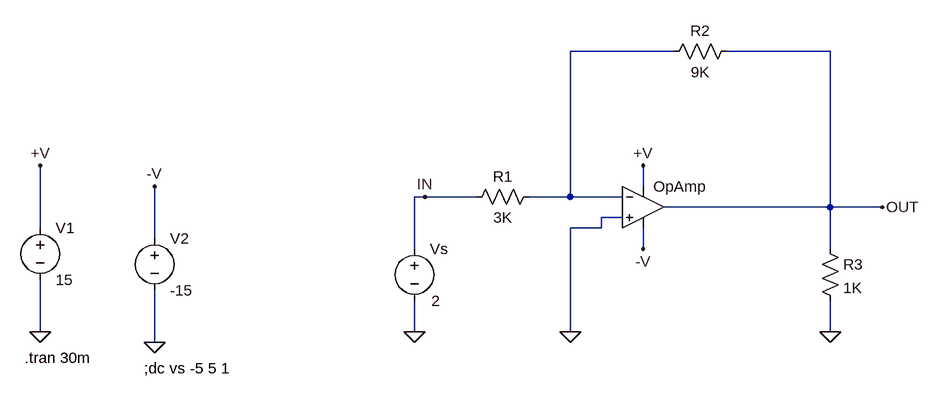
[diagram p0: schematic hw3.asc]
hw3.asc, the LTspice schematic file:
Version 4
SHEET 1 880 680
WIRE 448 -224 288 -224
WIRE 688 -224 528 -224
WIRE 400 -16 400 -48
WIRE 64 0 48 0
WIRE 144 0 64 0
WIRE 288 0 288 -224
WIRE 288 0 224 0
WIRE 368 0 288 0
WIRE 688 16 688 -224
WIRE 688 16 432 16
WIRE 768 16 688 16
WIRE 368 32 336 32
WIRE -528 48 -528 -48
WIRE 336 48 336 32
WIRE 336 48 288 48
WIRE -352 64 -352 -16
WIRE 48 80 48 0
WIRE 400 80 400 48
WIRE 688 80 688 16
WIRE -528 208 -528 128
WIRE 48 208 48 160
WIRE 288 208 288 48
WIRE 688 208 688 160
WIRE -352 224 -352 144
FLAG 48 208 0
FLAG 688 208 0
FLAG 288 208 0
FLAG 64 0 IN
FLAG 768 16 OUT
FLAG 400 -48 +V
FLAG 400 80 -V
FLAG -528 208 0
FLAG -352 224 0
FLAG -528 -48 +V
FLAG -352 -16 -V
SYMBOL res 240 -16 R90
WINDOW 0 0 56 VBottom 2
WINDOW 3 32 56 VTop 2
SYMATTR InstName R1
SYMATTR Value 3K
SYMBOL voltage 48 64 R0
WINDOW 3 40 96 Right 2
SYMATTR Value 2
SYMATTR InstName Vs
SYMBOL res 544 -240 R90
WINDOW 0 0 56 VBottom 2
WINDOW 3 32 56 VTop 2
SYMATTR InstName R2
SYMATTR Value 9K
SYMBOL res 672 64 R0
SYMATTR InstName R3
SYMATTR Value 1K
SYMBOL Opamps\\UniversalOpamp2 400 16 R0
SYMATTR InstName OpAmp
SYMBOL voltage -352 48 R0
SYMATTR InstName V2
SYMATTR Value -15
SYMBOL voltage -528 32 R0
SYMATTR InstName V1
SYMATTR Value 15
TEXT -552 248 Left 2 !.tran 30m
TEXT -368 264 Left 2 !;dc vs -5 5 1

The netlist it stands for:
* hw3.asc
R1 N001 IN 3K
Vs IN 0 2
R2 OUT N001 9K
R3 OUT 0 1K
XOpAmp 0 N001 +V -V OUT level.2 Avol=1Meg GBW=10Meg Slew=10Meg ilimit=25m rail=0 Vos=0 phimargin=45 en=0 enk=0 in=0 ink=0 Rin=500Meg  ; pins IN+ IN- V+ V- OUT
V2 -V 0 -15
V1 +V 0 15
.tran 30m
;dc vs -5 5 1
.lib UniversalOpamps2.sub
.backanno
.end